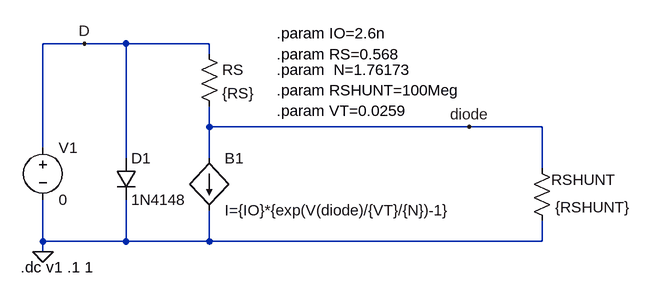
[diagram p0: schematic Diode4148.asc]
Diode4148.asc, the LTspice schematic file:
Version 4
SHEET 1 932 680
WIRE 80 -16 16 -16
WIRE 144 -16 80 -16
WIRE 272 -16 144 -16
WIRE 272 0 272 -16
WIRE 272 112 272 80
WIRE 672 112 272 112
WIRE 784 112 672 112
WIRE 16 144 16 -16
WIRE 144 160 144 -16
WIRE 272 160 272 112
WIRE 784 176 784 112
WIRE 16 288 16 224
WIRE 144 288 144 224
WIRE 144 288 16 288
WIRE 272 288 272 240
WIRE 272 288 144 288
WIRE 784 288 784 256
WIRE 784 288 272 288
WIRE 16 304 16 288
FLAG 16 304 0
FLAG 672 112 diode
FLAG 80 -16 D
SYMBOL voltage 16 128 R0
WINDOW 123 0 0 Left 0
WINDOW 39 0 0 Left 0
SYMATTR InstName V1
SYMATTR Value 0
SYMBOL diode 128 160 R0
SYMATTR InstName D1
SYMATTR Value 1N4148
SYMBOL bi 272 160 R0
SYMATTR InstName B1
SYMATTR Value I={IO}*{exp(V(diode)/{VT}/{N})-1}
SYMBOL res 256 -16 R0
SYMATTR InstName RS
SYMATTR Value {RS}
SYMBOL res 768 160 R0
WINDOW 0 30 33 Left 2
SYMATTR InstName RSHUNT
SYMATTR Value {RSHUNT}
TEXT 376 -32 Left 2 !.param IO=2.6n
TEXT 376 0 Left 2 !.param RS=0.568
TEXT 376 24 Left 2 !.param  N=1.76173
TEXT 376 56 Left 2 !.param RSHUNT=100Meg\n.param VT=0.0259
TEXT -18 328 Left 2 !.dc v1 .1 1

The netlist it stands for:
* Diode4148.asc
V1 D 0 0
D1 D 0 1N4148
B1 diode 0 I={IO}*{exp(V(diode)/{VT}/{N})-1}
RS D diode {RS}
RSHUNT diode 0 {RSHUNT}
.model D D
.lib standard.dio
.param IO=2.6n
.param RS=0.568
.param  N=1.76173
.param RSHUNT=100Meg
.param VT=0.0259
.dc v1 .1 1
.backanno
.end

* Results of the author's LTspice run, read from the files saved beside the schematic
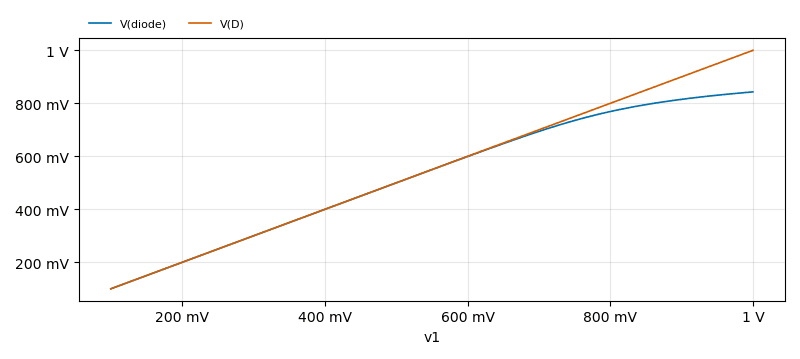
[diagram p1: DC transfer characteristic of Diode4148.asc, plotted from the saved traces]
* DC transfer characteristic, 1 run:
*   V(diode): 100 mV at v1=100 mV, 843.2 mV at v1=1 V, min 100 mV, max 843.2 mV
*   V(D): 100 mV at v1=100 mV, 1 V at v1=1 V, min 100 mV, max 1 V